# Altium schematic sheet S7CAS-PLEIADES-CARTE-MERE_Pxx_DDR.SchDoc
size Tabloid; SheetNumber: 4; SheetTotal: 18; Sheet_Name: DDR; Size: 11x17
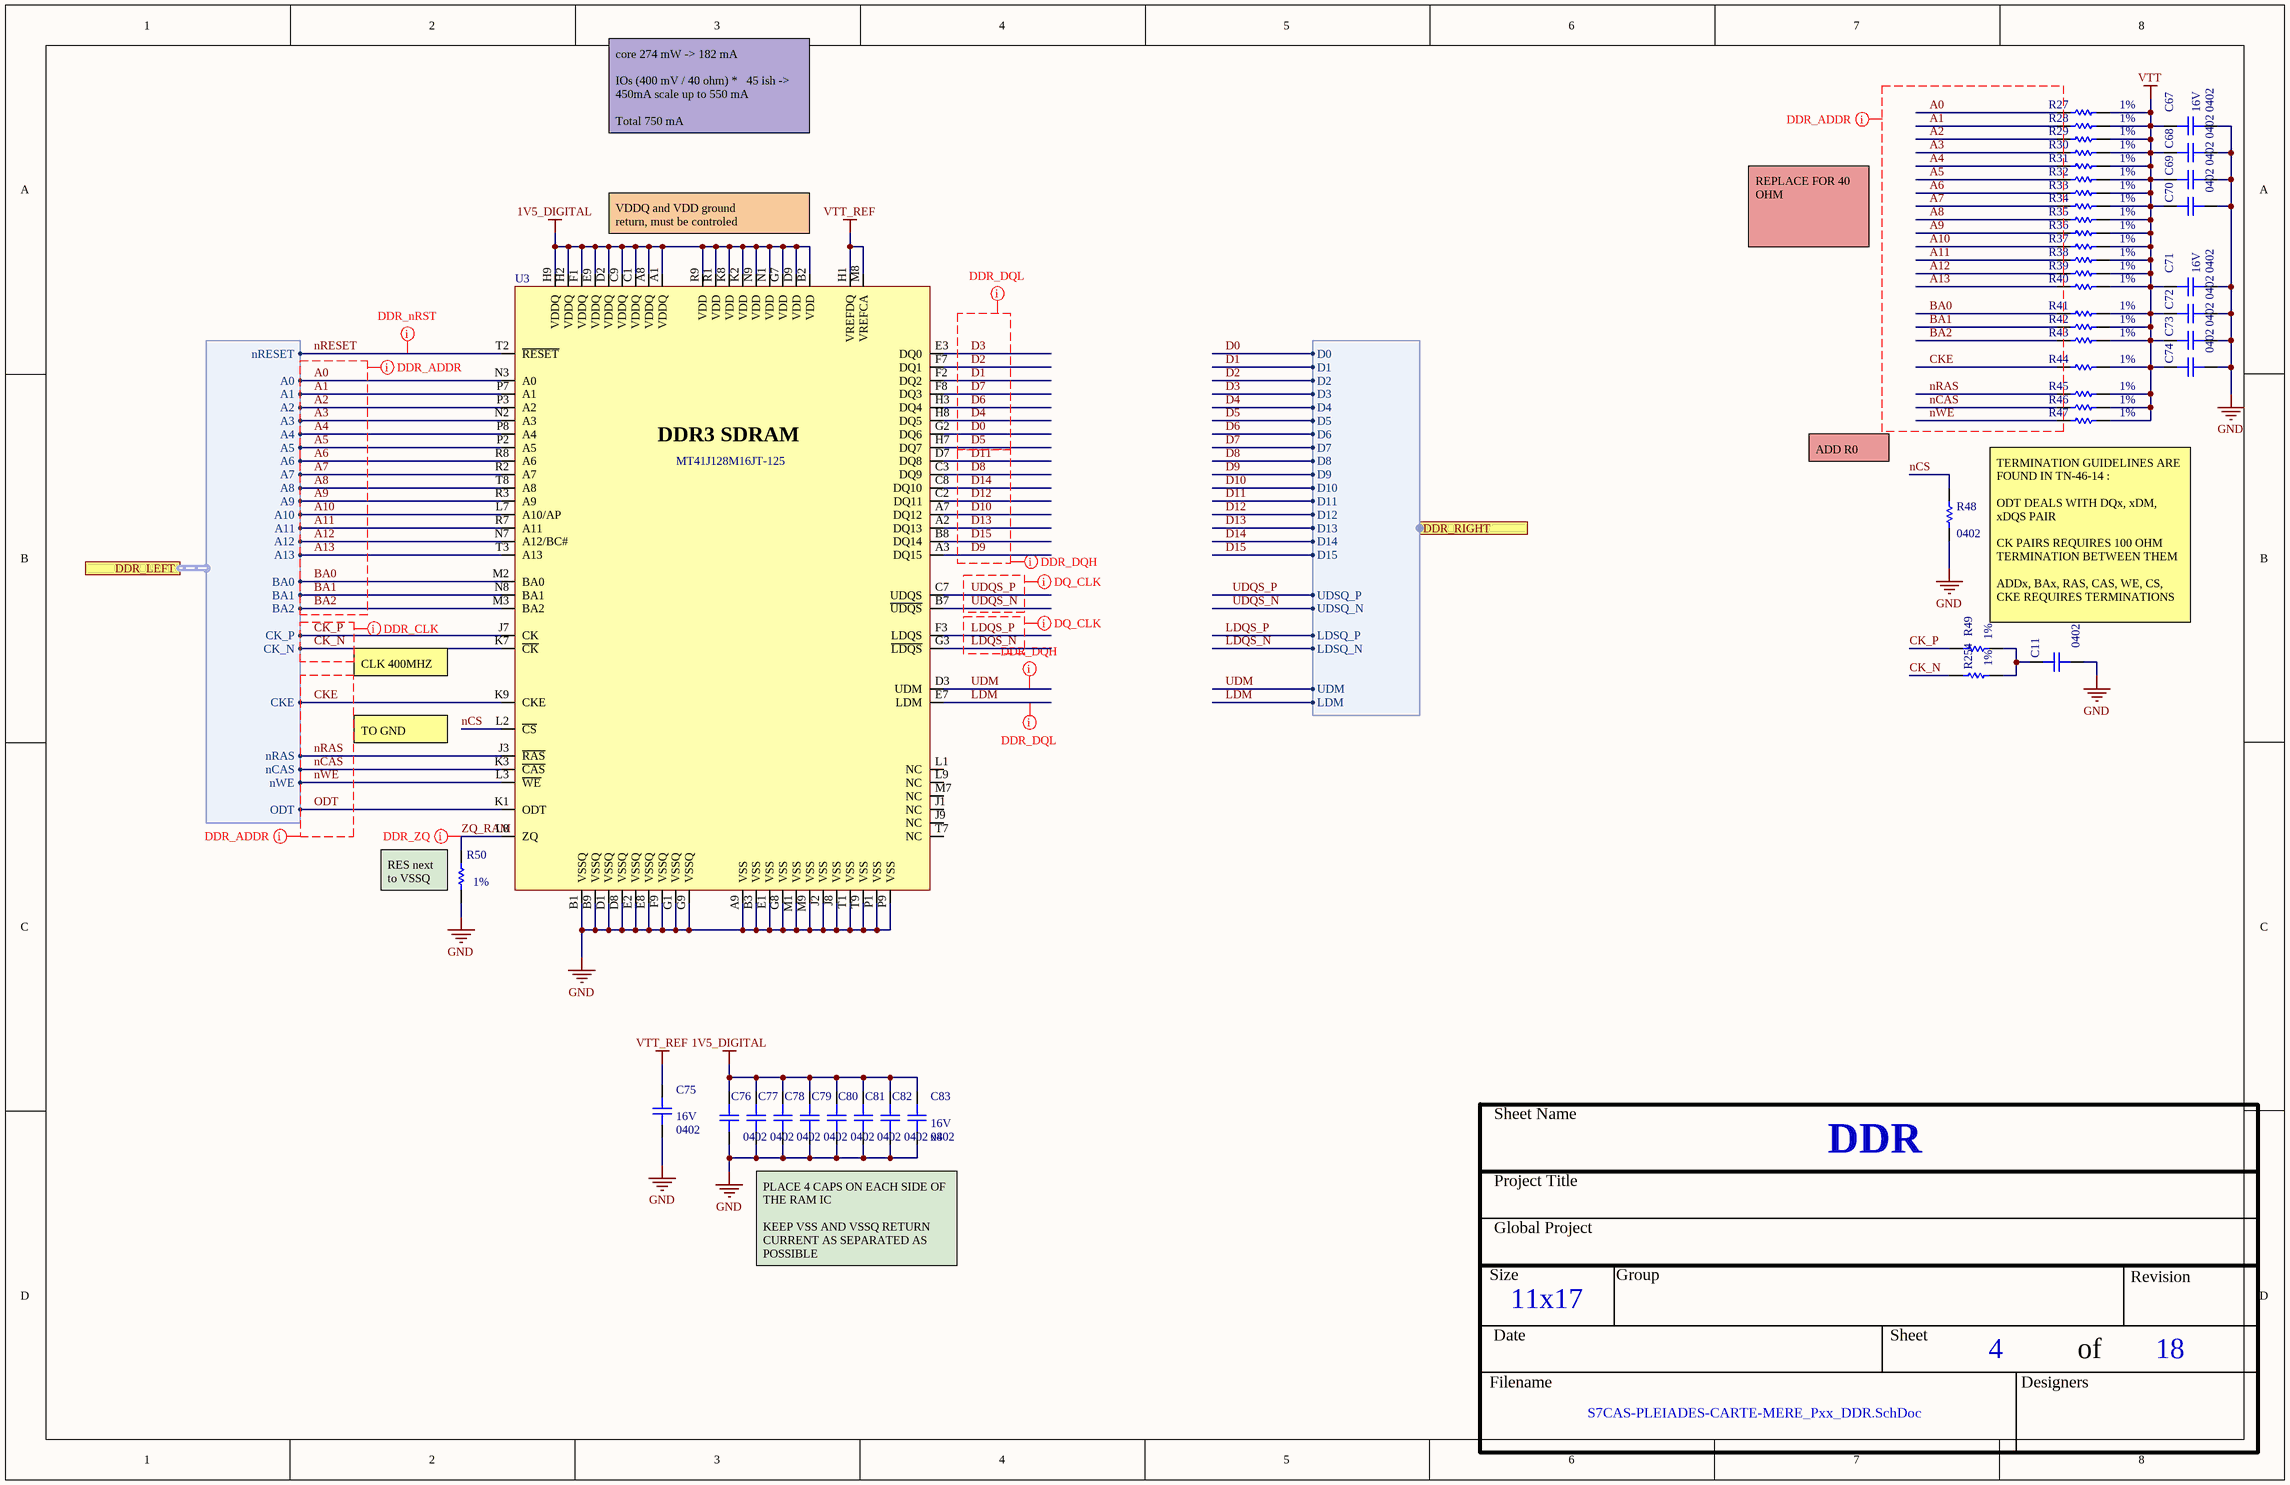
[diagram p0: S7CAS-PLEIADES-CARTE-MERE_Pxx_DDR.SchDoc]

## Parts
C11  0402  [CAP_0402]
C67  Voltage: 16V  [CAP_0402]  (hidden comment: 0402)
C68  0402  [CAP_0402]
C69  0402  [CAP_0402]
C70  0402  [CAP_0402]
C71  Voltage: 16V  [CAP_0402]  (hidden comment: 0402)
C72  0402  [CAP_0402]
C73  0402  [CAP_0402]
C74  0402  [CAP_0402]
C75  Voltage: 16V  [CAP_0402]  (hidden comment: 0402)
C76  0402  [CAP_0402]
C77  0402  [CAP_0402]
C78  0402  [CAP_0402]
C79  0402  [CAP_0402]
C80  0402  [CAP_0402]
C81  0402  [CAP_0402]
C82  0402  [CAP_0402]
C83  Voltage: 16V  [CAP_0402]  (hidden comment: 0402)
R27  Precision: 1%  [RES_0402]  (hidden comment: RES - 0603)
R28  Precision: 1%  [RES_0402]  (hidden comment: RES - 0603)
R29  Precision: 1%  [RES_0402]  (hidden comment: RES - 0603)
R30  Precision: 1%  [RES_0402]  (hidden comment: RES - 0603)
R31  Precision: 1%  [RES_0402]  (hidden comment: RES - 0603)
R32  Precision: 1%  [RES_0402]  (hidden comment: RES - 0603)
R33  Precision: 1%  [RES_0402]  (hidden comment: RES - 0603)
R34  Precision: 1%  [RES_0402]  (hidden comment: RES - 0603)
R35  Precision: 1%  [RES_0402]  (hidden comment: RES - 0603)
R36  Precision: 1%  [RES_0402]  (hidden comment: RES - 0603)
R37  Precision: 1%  [RES_0402]  (hidden comment: RES - 0603)
R38  Precision: 1%  [RES_0402]  (hidden comment: RES - 0603)
R39  Precision: 1%  [RES_0402]  (hidden comment: RES - 0603)
R40  Precision: 1%  [RES_0402]  (hidden comment: RES - 0603)
R41  Precision: 1%  [RES_0402]  (hidden comment: RES - 0603)
R42  Precision: 1%  [RES_0402]  (hidden comment: RES - 0603)
R43  Precision: 1%  [RES_0402]  (hidden comment: RES - 0603)
R44  Precision: 1%  [RES_0402]  (hidden comment: RES - 0603)
R45  Precision: 1%  [RES_0402]  (hidden comment: RES - 0603)
R46  Precision: 1%  [RES_0402]  (hidden comment: RES - 0603)
R47  Precision: 1%  [RES_0402]  (hidden comment: RES - 0603)
R48  Package: 0402  [RES_0402]  (hidden comment: RES - 0603)
R49  Precision: 1%  [RES_0402]  (hidden comment: RES - 0603)
R50  Precision: 1%  [RES_0402]  (hidden comment: RES - 0603)
R254  Precision: 1%  [RES_0402]  (hidden comment: RES - 0603)
U3  MT41J128M16JT-125  [MEM_DDR3_MT41J128M16JT-125]

## Ports
DDR_LEFT (harness ddr_left, see S7CAS-PLEIADES-CARTE-MERE_Pxx_FPGA_bank0_1_5[1C]), DDR_RIGHT (harness ddr_right, see S7CAS-PLEIADES-CARTE-MERE_Pxx_FPGA_bank0_1_5[3C])

## Harnesses
ddr_left: ODT, nRAS, nCAS, nWE, CKE, CK_P, CK_N, BA0, BA1, BA2, A0, A1, A2, A3, A4, A5, A6, A7, A8, A9, A10, A11, A12, A13, nRESET
ddr_right: D0, D1, D2, D3, D4, D5, D6, D7, D8, D9, D10, D11, D12, D13, D14, D15, UDSQ_P, UDSQ_N, LDSQ_N, LDSQ_P, UDM, LDM

## Nets
1V5_DIGITAL: C76.2 C77.2 C78.2 C79.2 C80.2 C81.2 C82.2 C83.2 U3.A1(VDDQ) U3.A8(VDDQ) U3.B2(VDD) U3.C1(VDDQ) U3.C9(VDDQ) U3.D2(VDDQ) U3.D9(VDD) U3.E9(VDDQ) U3.F1(VDDQ) U3.G7(VDD) U3.H2(VDDQ) U3.H9(VDDQ) U3.K2(VDD) U3.K8(VDD) U3.N1(VDD) U3.N9(VDD) U3.R1(VDD) U3.R9(VDD)
GND: C11.1 C67.1 C68.1 C69.1 C70.1 C71.1 C72.1 C73.1 C74.1 C75.1 C76.1 C77.1 C78.1 C79.1 C80.1 C81.1 C82.1 C83.1 R48.1 R50.1 U3.A9(VSS) U3.B1(VSSQ) U3.B3(VSS) U3.B9(VSSQ) U3.D1(VSSQ) U3.D8(VSSQ) U3.E1(VSS) U3.E2(VSSQ) U3.E8(VSSQ) U3.F9(VSSQ) U3.G1(VSSQ) U3.G8(VSS) U3.G9(VSSQ) U3.J2(VSS) U3.J8(VSS) U3.M1(VSS) U3.M9(VSS) U3.P1(VSS) U3.P9(VSS) U3.T1(VSS) U3.T9(VSS)
VTT: C67.2 C68.2 C69.2 C70.2 C71.2 C72.2 C73.2 C74.2 R27.1 R28.1 R29.1 R30.1 R31.1 R32.1 R33.1 R34.1 R35.1 R36.1 R37.1 R38.1 R39.1 R40.1 R41.1 R42.1 R43.1 R44.1 R45.1 R46.1 R47.1
VTT_REF: C75.2 U3.H1(VREFDQ) U3.M8(VREFCA)
A0: R27.2 U3.N3(A0) ; port DDR_LEFT.A0
A1: R28.2 U3.P7(A1) ; port DDR_LEFT.A1
A2: R29.2 U3.P3(A2) ; port DDR_LEFT.A2
A3: R30.2 U3.N2(A3) ; port DDR_LEFT.A3
A4: R31.2 U3.P8(A4) ; port DDR_LEFT.A4
A5: R32.2 U3.P2(A5) ; port DDR_LEFT.A5
A6: R33.2 U3.R8(A6) ; port DDR_LEFT.A6
A7: R34.2 U3.R2(A7) ; port DDR_LEFT.A7
A8: R35.2 U3.T8(A8) ; port DDR_LEFT.A8
A9: R36.2 U3.R3(A9) ; port DDR_LEFT.A9
A10: R37.2 U3.L7(A10/AP) ; port DDR_LEFT.A10
A11: R38.2 U3.R7(A11) ; port DDR_LEFT.A11
A12: R39.2 U3.N7(A12/BC#) ; port DDR_LEFT.A12
A13: R40.2 U3.T3(A13) ; port DDR_LEFT.A13
BA0: R41.2 U3.M2(BA0) ; port DDR_LEFT.BA0
BA1: R42.2 U3.N8(BA1) ; port DDR_LEFT.BA1
BA2: R43.2 U3.M3(BA2) ; port DDR_LEFT.BA2
CK_N: R254.2 U3.K7(~{CK}) ; port DDR_LEFT.CK_N
CK_P: R49.2 U3.J7(CK) ; port DDR_LEFT.CK_P
CKE: R44.2 U3.K9(CKE) ; port DDR_LEFT.CKE
D0: U3.G2(DQ6) ; port DDR_RIGHT.D0
D1: U3.F2(DQ2) ; port DDR_RIGHT.D1
D2: U3.F7(DQ1) ; port DDR_RIGHT.D2
D3: U3.E3(DQ0) ; port DDR_RIGHT.D3
D4: U3.H8(DQ5) ; port DDR_RIGHT.D4
D5: U3.H7(DQ7) ; port DDR_RIGHT.D5
D6: U3.H3(DQ4) ; port DDR_RIGHT.D6
D7: U3.F8(DQ3) ; port DDR_RIGHT.D7
D8: U3.C3(DQ9) ; port DDR_RIGHT.D8
D9: U3.A3(DQ15) ; port DDR_RIGHT.D9
D10: U3.A7(DQ12) ; port DDR_RIGHT.D10
D11: U3.D7(DQ8) ; port DDR_RIGHT.D11
D12: U3.C2(DQ11) ; port DDR_RIGHT.D12
D13: U3.A2(DQ13) ; port DDR_RIGHT.D13
D14: U3.C8(DQ10) ; port DDR_RIGHT.D14
D15: U3.B8(DQ14) ; port DDR_RIGHT.D15
LDM: U3.E7(LDM) ; port DDR_RIGHT.LDM
LDQS_N: U3.G3(~{LDQS}) ; port DDR_RIGHT.LDSQ_N
LDQS_P: U3.F3(LDQS) ; port DDR_RIGHT.LDSQ_P
nCAS: R46.2 U3.K3(~{CAS}) ; port DDR_LEFT.nCAS
nCS: R48.2 U3.L2(~{CS})
nRAS: R45.2 U3.J3(~{RAS}) ; port DDR_LEFT.nRAS
nRESET: U3.T2(~{RESET}) ; port DDR_LEFT.nRESET
nWE: R47.2 U3.L3(~{WE}) ; port DDR_LEFT.nWE
ODT: U3.K1(ODT) ; port DDR_LEFT.ODT
UDM: U3.D3(UDM) ; port DDR_RIGHT.UDM
UDQS_N: U3.B7(~{UDQS}) ; port DDR_RIGHT.UDSQ_N
UDQS_P: U3.C7(UDQS) ; port DDR_RIGHT.UDSQ_P
ZQ_RAM: R50.2 U3.L8(ZQ)
NetC11_2: C11.2 R49.1 R254.1

Not connected (* = marked no-connect by the designer): U3 J1(NC) J9(NC) L1(NC) L9(NC) M7(NC) T7(NC)

## Layout directives
net class DDR_ADDR; net class DDR_40OHM: A0, A1, A2, A3, A4, A5, A6, A7, A8, A9, A10, A11, A12, A13, BA0, BA1, BA2, CKE, nCAS, nRAS, nWE, ODT
net class DDR_DQL; net class DDR_40OHM: D0, D1, D2, D3, D4, D5, D6, D7, LDM
net class DDR_DQH; net class DDR_40OHM: D8, D9, D10, D11, D12, D13, D14, D15, UDM
differential pair; differential pair class DDR_CLK_DIFF_PAIR; differential pair class DDR_DIFF; net class DDR_40OHM; net class DDR_CLK: CK_N, CK_P
differential pair; differential pair class DQH_CLK_DIFF_PAIR; net class DDR_DQH; differential pair class DDR_DIFF: UDQS_N, UDQS_P
differential pair; differential pair class DQL_CLK_DIFF_PAIR; net class DDR_DQL; differential pair class DDR_DIFF: LDQS_N, LDQS_P
net class DDR_ADDR: A0, A1, A2, A3, A4, A5, A6, A7, A8, A9, A10, A11, A12, A13, BA0, BA1, BA2, CKE, nCAS, nRAS, nWE
net class DDR_40OHM: nRESET, ZQ_RAM

## Notes on the sheet
- core 274 mW -> 182 mA
  IOs (400 mV / 40 ohm) *   45 ish -> 450mA scale up to 550 mA
  Total 750 mA
- VDDQ and VDD ground
  return, must be controled
- REPLACE FOR 40 OHM
- ADD R0
- TERMINATION GUIDELINES ARE FOUND IN TN-46-14 :
  ODT DEALS WITH DQx, xDM, xDQS PAIR
  CK PAIRS REQUIRES 100 OHM TERMINATION BETWEEN THEM
  ADDx, BAx, RAS, CAS, WE, CS, CKE REQUIRES TERMINATIONS
- CLK 400MHZ
- TO GND
- (near R50) RES next to VSSQ
- (near C83) x8
- PLACE 4 CAPS ON EACH SIDE OF THE RAM IC
  KEEP VSS AND VSSQ RETURN CURRENT AS SEPARATED AS POSSIBLE
- Sheet Name
- Project Title
- Global Project
- Size
- Group
- Revision
- Date
- Sheet
- of
- Filename
- Designers
- (in symbol MEM_DDR3_MT41J128M16JT-125:K TR) DDR3 SDRAM

## Library data of the parts
C11 C68-C70 C72-C74 C76-C82 = CAP - 0603: CAP - 0402; Precision: 10%; Voltage: 16V; Current: *; CreatedBy: Jonathan Bouchard; Power: *; Package: 0402; Supplier 1: Arrow Electronics; Supplier Part Number 1: CL10B104KO8NNNC; Parameter 1: *
C67 C71 C75 C83 = CAP - 0603: CAP - 0402; Precision: 10%; Current: *; CreatedBy: Jonathan Bouchard; Power: *; Package: 0402; Supplier 1: Arrow Electronics; Supplier Part Number 1: CL10B104KO8NNNC; Parameter 1: *
R27-R47 R49 R50 R254 = RES - 0603: RES - 0402; Current: *; CreatedBy: Jonathan Bouchard; Package: 0402; Supplier 1: Arrow Electronics; Parameter 1: *
  R27-R47: Supplier Part Number 1: RMCF0603FT30R0
  R49 R254: Supplier Part Number 1: RMCF0603FT100R
  R50: Supplier Part Number 1: RMCF0603FT240R
R48 = RES - 0603: RES - 0402; Precision: 1%; Current: *; CreatedBy: Jonathan Bouchard; Supplier 1: Arrow Electronics; Supplier Part Number 1: RMCF0603ZT0R00; Parameter 1: *
U3 = MEM_DDR3_MT41J128M16JT-125:K TR: MEM - DDR3 SDRAM 2GBIT 800MHZ - TFBGA-96; Voltage: 1.425 V ~ 1.575 V; Mfg: Micrel; Current: *; Power: *; Mfg Part Number: MT41J128M16JT-125; HelpURL: http://www.micron.com/~/media/Documents/Products/Data%20Sheet/DRAM/DDR3/2Gb_DDR3_SDRAM.pdf; CreatedBy: Jonathan Bouchard; Temperature: 0°C ~ 95°C (TC); Precision: *; Package: TFBGA-96; Supplier 1: Digikey; Supplier Part Number 1: 557-1611-1-ND; Parameter 1: *